# EAGLE schematic tetris_nosound (EAGLE 6.2)
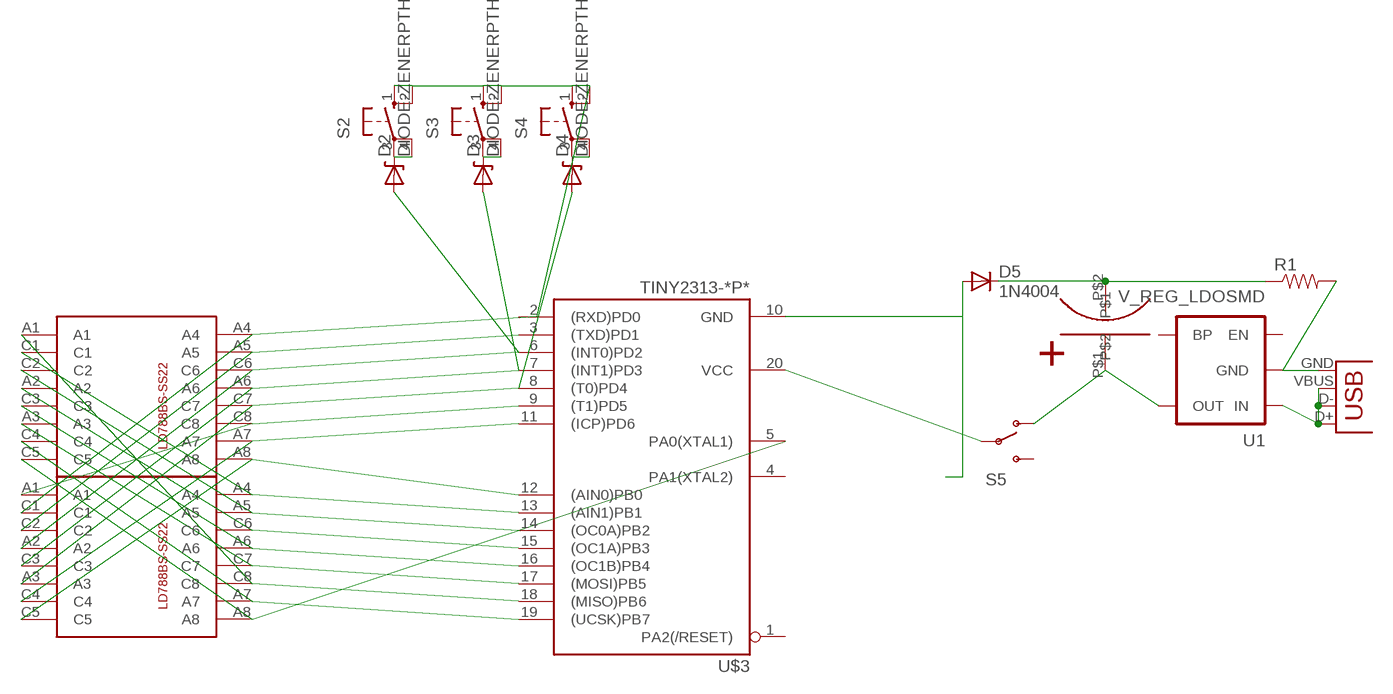
[diagram p0: schematic, sheet 1]

## Parts
D2  DIODE-ZENERPTH  [DIODE-ZENER]
D3  DIODE-ZENERPTH  [DIODE-ZENER]
D4  DIODE-ZENERPTH  [DIODE-ZENER]
D5  1N4004  [DO41-10]
R1  RESISTORPTH1  [AXIAL-0.3]
S2  10-XX  [B3F-10XX]
S3  10-XX  [B3F-10XX]
S4  10-XX  [B3F-10XX]
S5  SWITCH-SPSTSMD2  [SWITCH-SPDT-SMD]
U1  V_REG_LDOSMD  [SOT23-5]
U$1  LD788BS-SS22  [LD788BS-SS22]
U$2  LD788BS-SS22  [LD788BS-SS22]
U$3  TINY2313-*P*  [DIL20]
U$5  NICHICON_12F  [NICHICON_10X30]
X1  USB-MICROB  [USB-MICROB]

## Nets
N$1: U$1.A4 U$2.C1 U$3.13((AIN1)PB1)
N$2: U$1.A5 U$2.C2 U$3.14((OC0A)PB2)
N$3: U$1.C6 U$2.A2 U$3.15((OC1A)PB3)
N$4: U$1.A6 U$2.C3 U$3.16((OC1B)PB4)
N$5: U$1.C7 U$2.A3 U$3.17((MOSI)PB5)
N$6: U$1.A7 U$2.C4 U$3.19((UCSK)PB7)
N$7: U$1.A8 U$2.C5 U$3.5(PA0(XTAL1))
N$8: U$1.C8 U$2.A1 U$3.18((MISO)PB6)
N$9: D5.C R1.P$1 U$5.P$2
N$10: U$1.C2 U$2.A5 U$3.3((TXD)PD1)
N$11: D2.P$2(A) U$1.A2 U$2.C6 U$3.6((INT0)PD2)
N$12: D3.P$2(A) U$1.C3 U$2.A6 U$3.7((INT1)PD3)
N$13: D4.P$2(A) U$1.A3 U$2.C7 U$3.8((T0)PD4)
N$14: U$1.A1 U$2.C8 U$3.9((T1)PD5)
N$15: U$1.C4 U$2.A7 U$3.11((ICP)PD6)
N$16: U$1.C5 U$2.A8 U$3.12((AIN0)PB0)
N$18: D5.A U$3.10(GND)
N$19: S5.1(O) U1.5(OUT) U$5.P$1
N$21: D2.P$1(C) S2.3(P) S2.4(P1)
N$22: D3.P$1(C) S3.3(P) S3.4(P1)
N$23: D4.P$1(C) S4.3(P) S4.4(P1)
N$24: R1.P$2 U1.2(GND) X1.GND
N$25: U1.1(IN) X1.D+ X1.D- X1.VBUS
N$26: S5.2(P) U$3.20(VCC)
N$27: S2.1(S) S2.2(S1) S3.1(S) S3.2(S1) S4.1(S) S4.2(S1) U$1.C1 U$2.A4
Unconnected: S5.3(S) U1.3(EN) U1.4(BP) U$3.1(PA2(/RESET)) U$3.2((RXD)PD0) U$3.4(PA1(XTAL2))

## Library data of the parts
D2-D4 = SparkFun:DIODE-ZENER: Zener Diode Production Part - 8199 3.4V Zener Voltage
D5 = adafruit:1N4004: DIODE General purpose 1N400x type rectifier (With bigger pads) http://www.ladyada.net/library/pcb/eaglelibrary.html
R1 = SparkFun:RESISTOR: Resistor Basic schematic elements and footprints for 0603, 1206, and PTH 1/10th watt (small) resistors.
S2-S4 = switch-omron:10-XX: OMRON SWITCH; MPN: B3F-1000; OC_FARNELL: 176432; OC_NEWARK: 36M3542
S5 = SparkFun:SWITCH-SPST: SPST Switch Simple slide switch. Spark Fun Electronics SKU : COM-00102
U1 = SparkFun:V_REG_LDO: Voltage Regulator LDO Standard 150mA LDO voltage regulator in SOT-23 layout. Micrel part MIC5205. BP (by-pass) pin is used to lower output noise with 470pF cap.
U$1 U$2 = mrule:LD788BS-SS22
U$3 = avr-6:TINY2313*: Atmel Tiny2313 2K Flash, 128 bytes EEPROM, 128 bytes RAM
U$5 = mrule:NICHICON_12F
X1 = SparkFun:USB: USB Connectors USB-B-PTH is fully proven SKU : PRT-00139 USB-miniB is fully proven SKU : PRT-00587 USB-A-PCB is untested. USB-A-H is throughly reviewed, but untested. Spark Fun Electronics SKU : PRT-00437 USB-B-SMT is throughly reviewed, but untested. Needs silkscreen touching up. USB-A-S has not been used/tested USB-MB-H has not been used/tested